# Altium schematic sheet SONAR.SchDoc
size A4
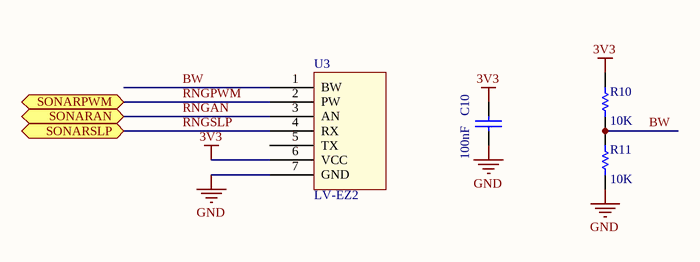
[diagram p0: SONAR.SchDoc]

## Parts
C10  CAP0805-100NF  [RESC2012L]  (value not drawn)
R10  value 10K  [RESC2012L]  (hidden comment: RES0805-10K)
R11  value 10K  [RESC2012L]  (hidden comment: RES0805-10K)
U3  LV-EZ2  [LV-EZ2]

## Ports
SONARAN, SONARPWM, SONARSLP

## Nets
3V3: C10.1 R10.2 U3.6(VCC)
GND: C10.2 R11.1 U3.7(GND)
BW: R10.1 R11.2 U3.1(BW)
RNGAN: U3.3(AN) ; port SONARAN
RNGPWM: U3.2(PW) ; port SONARPWM
RNGSLP: U3.4(RX) ; port SONARSLP

Not connected (* = marked no-connect by the designer): U3 5(TX)

## Notes on the sheet
- (in symbol CAP 0805 100nF) 100nF

## Library data of the parts
C10 = CAP 0805 100nF
R10 R11 = Res Semi: Semiconductor Resistor; Published: 8-Jun-2000; LatestRevisionDate: 17-Jul-2002; LatestRevisionNote: Re-released for DXP Platform.; PackageReference: AXIAL-0.5; Publisher: Altium Limited; PackageDescription: Axial Device, Thru-Hole; 2 Leads; 0.5 in Pin Spacing
U3 = LV-EZ2: Ultrasonic Sensor